# EAGLE design xor-oscillator (EAGLE 5.11)
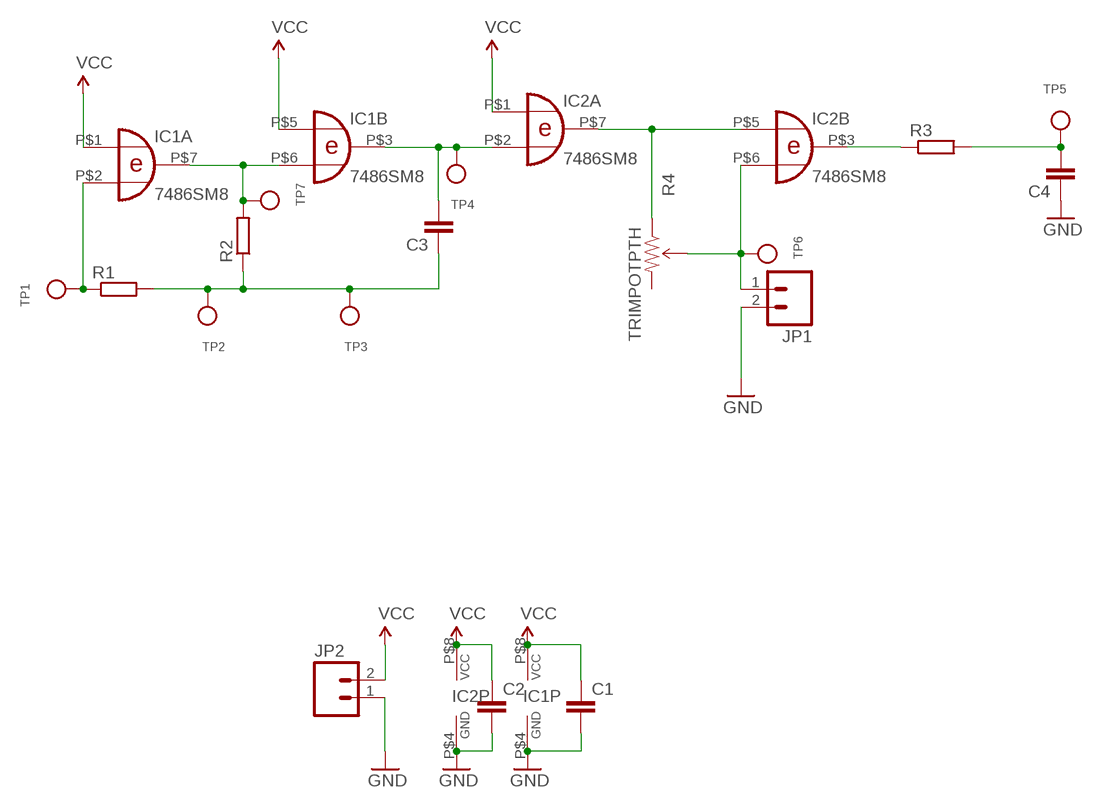
[diagram p0: schematic, sheet 1]

## Parts
C1  C-EUC0603  [C0603]
C2  C-EUC0603  [C0603]
C3  C-EUC0805  [C0805]
C4  C-EUC0805  [C0805]
IC1  7486SM8  [SM8(DCT)]
IC2  7486SM8  [SM8(DCT)]
JP1  M02PTH3  [1X02_LONGPADS]
JP2  M02PTH3  [1X02_LONGPADS]
R1  R-EU_R0805  [R0805]
R2  R-EU_R0805  [R0805]
R3  R-EU_R0805  [R0805]
R4  TRIMPOTPTH  [TRIM_POT_PTH]
TP1  TESTPOINTPAD  [TESTPOINT_PAD_2MM]
TP2  TESTPOINTPAD  [TESTPOINT_PAD_2MM]
TP3  TESTPOINTPAD  [TESTPOINT_PAD_2MM]
TP4  TESTPOINTPAD  [TESTPOINT_PAD_2MM]
TP5  TESTPOINTPAD  [TESTPOINT_PAD_2MM]
TP6  TESTPOINTPAD  [TESTPOINT_PAD_2MM]
TP7  TESTPOINTPAD  [TESTPOINT_PAD_2MM]

## Nets
GND: C1.2 C2.2 C4.1 IC1.P$4(P:GND) IC2.P$4(P:GND) JP1.2 JP2.1
N$1: IC1.P$6(B:I1) IC1.P$7(A:O) R2.2 TP7.P$1
N$3: C3.1 R1.2 R2.1 TP2.P$1 TP3.P$1
N$4: IC1.P$2(A:I1) R1.1 TP1.P$1
N$6: IC2.P$3(B:O) R3.1
N$7: C4.2 R3.2 TP5.P$1
N$8: IC2.P$6(B:I1) JP1.1 R4.2(WIPER) TP6.P$1
OSC: C3.2 IC1.P$3(B:O) IC2.P$2(A:I1) TP4.P$1
OSC_OUT: IC2.P$5(B:I0) IC2.P$7(A:O) R4.1(CCW)
VCC: C1.1 C2.1 IC1.P$1(A:I0) IC1.P$5(B:I0) IC1.P$8(P:VCC) IC2.P$1(A:I0) IC2.P$8(P:VCC) JP2.2
Unconnected: R4.3(CW)

## Library data of the parts
C1-C4 = rcl:C-EU: CAPACITOR, European symbol
IC1 IC2 = mic-misc:74*86: Quad 2-input EXCLUSIVE-OR (XOR) gate
JP1 JP2 = SparkFun:M02: Header 2 Standard 2-pin 0.1" header. Use with straight break away headers (SKU : PRT-00116), right angle break away headers (PRT-00553), swiss pins (PRT-00743), machine pins (PRT-00117), and female headers (PRT-00115). Molex polarized connector foot print use with SKU : PRT-08233 with associated crimp pins and housings.
R1-R3 = resistor:R-EU_: RESISTOR, European symbol
R4 = SparkFun:TRIMPOT
TP1-TP7 = microbuilder:TESTPOINT: Test Point TESTPOINT_SMT - Compact Surface Mount Test Point [Digikey: 5016KTR-ND] TESTPOINT_PAD - Square Pad (2mm) TESTPOINT_SMT - Round Pad (2mm) TESTPOINT_0.1" - 0.1" Header

## Board
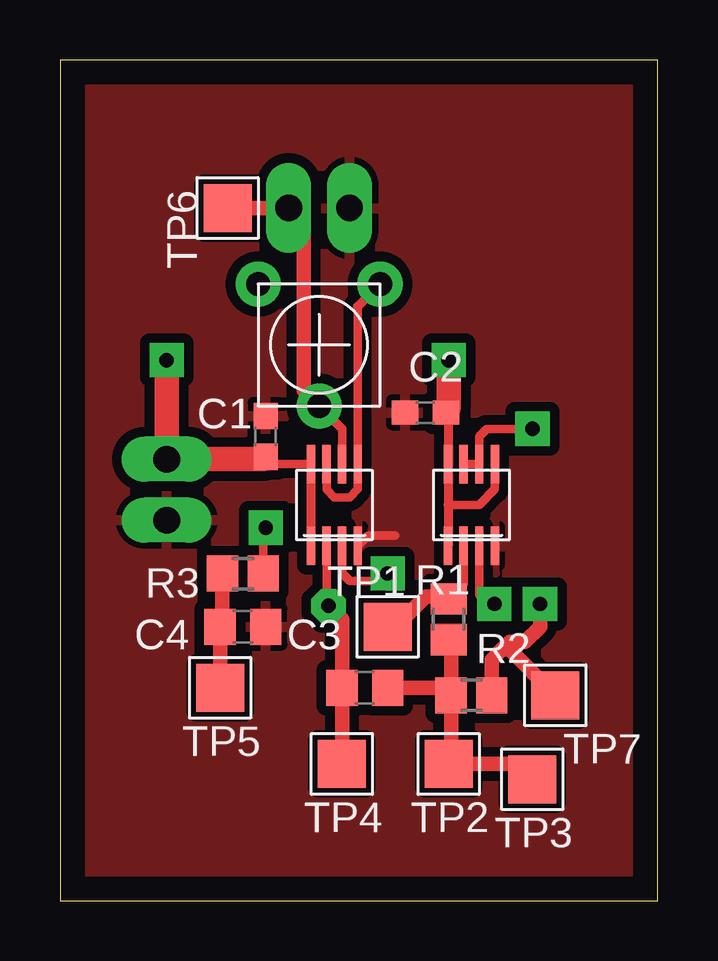
[diagram p1: board, top side]
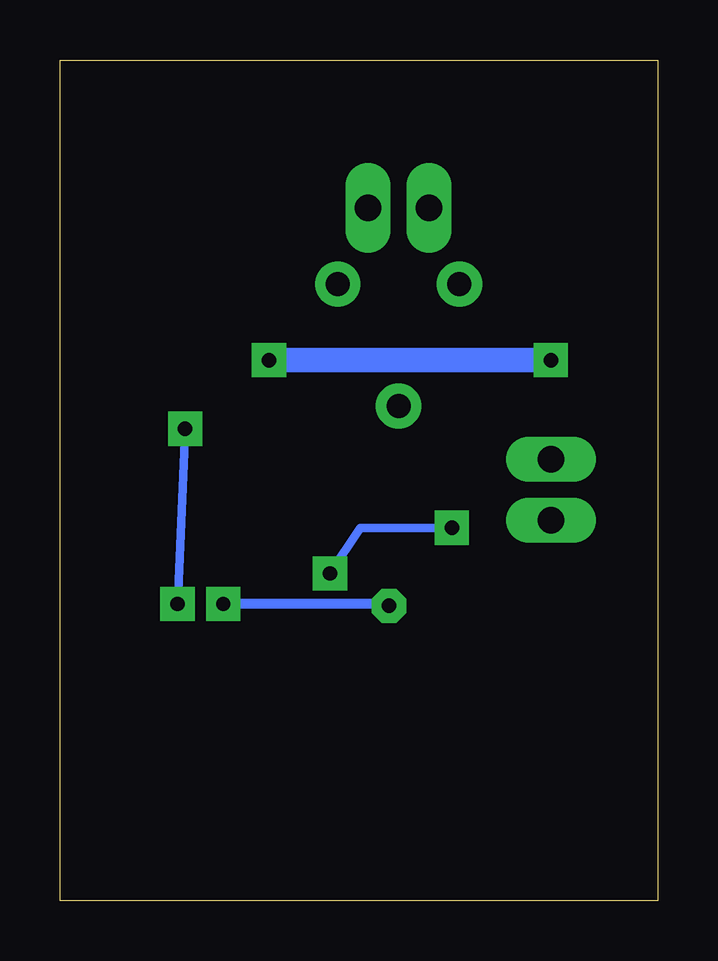
[diagram p2: board, bottom side, seen from below]

Size 24.9 x 35.06 mm. Coordinates in mm from the lower left corner, seen from the top.
Outline: 0,0 24.9,0 24.9,35.06 0,35.06 0,0
Copper layers (1*16): Top 0.035mm / dielectric 1.5mm / Bottom 0.035mm
Design rules "default": minimum track width 10mil, minimum drill 24mil, track to track 8mil, track to pad 8mil, pad to pad 8mil, via to via 8mil, smd to smd 8mil, copper to edge 40mil, drill to drill 8mil, minimum pad ring 10mil, minimum via ring 8mil, stop-mask expansion 4mil, vias tented up to drill 0mil, thermal gap 10mil

### Footprints (pad centres in the part's own frame; a part is rotated, then mirrored left to right if it is on the bottom)
C0603 = smd 1.1 x 1: 1 -0.85,0; 2 0.85,0
C0805 = smd 1.3 x 1.5: 1 -0.95,0; 2 0.95,0
SM8(DCT) = smd 0.35 x 1.6: P$1 -0.975,-1.7; P$2 -0.325,-1.7; P$3 0.325,-1.7; P$4 0.975,-1.7; P$5 0.975,1.7; P$6 0.325,1.7; P$7 -0.325,1.7; P$8 -0.975,1.7
1X02_LONGPADS = drill 1.118 pad 1.88 long: 1 0,0; 2 2.54,0
R0805 = smd 1.3 x 1.5: 1 -0.85,0; 2 0.85,0
TRIM_POT_PTH = drill 1 pad 1.88 round: 1 -2.54,-2.54; 2 0,2.54; 3 2.54,-2.54
TESTPOINT_PAD_2MM = smd 2 x 2: P$1 0,0

### Placement (x,y rotation side)
C1  8.57,19.37 90 top
C2  15.22,20.36 180 top
C3  12.7,8.89 180 top
C4  7.62,11.43 180 top
IC1  17.14,16.51 0 top
IC2  11.43,16.51 0 top
JP1  9.53,28.89 0 top
JP2  4.45,15.88 90 top
R1  16.19,11.75 270 top
R2  17.14,8.57 0 top
R3  7.62,13.65 180 top
R4  10.79,23.18 180 top
TP1  13.65,11.43 0 top
TP2  16.19,5.71 0 top
TP3  19.68,5.08 0 top
TP4  11.75,5.71 0 top
TP5  6.67,8.89 0 top
TP6  6.99,28.89 90 top
TP7  20.64,8.57 0 top

### Tracks (layer width: path | path; a pad name or v marks a point on that pad's centre or on a via)
GND
  Top 0.356: IC2.P$4 12.84,15.24 13.97,15.24
  pour Top (isolate 0.406): 0,35.24 24.13,35.24 24.13,0 0,0
N$1  (via drill 0.6 pad 1.42)
  Top 0.356: IC1.P$7 IC1.P$6 17.46,19.37 17.78,19.68 v19.68,19.68
  Top 0.61: R2.2 18,10.06 18.41,10.48 | 18.41,10.48 18.73,10.79 19.37,10.79 20,11.43 v20,12.38 | TP7.P$1 18.73,10.48 18.41,10.48
  Bottom 0.356: v20,12.38 v19.68,19.68
N$3
  Top 0.61: R1.2 16.3,10.79 R2.1 | C3.1 15.98,8.89 R2.1 | R2.1 16.3,5.82 TP2.P$1 19.05,5.71 TP3.P$1
N$4
  Top 0.356: IC1.P$2 16.82,13.22 R1.1
  Top 0.61: R1.1 16.09,12.7 15.24,12.7 13.97,11.43 TP1.P$1
N$6  (via drill 0.6 pad 1.42)
  Top 0.356: IC2.P$3 11.76,13.64 12.06,13.34 13.34,13.34 v13.65,13.65 | v8.57,15.56 8.47,15.46 R3.1
  Bottom 0.356: v13.65,13.65 12.38,15.56 v8.57,15.56
N$7
  Top 0.61: R3.2 6.77,11.53 C4.2 TP5.P$1
N$8
  Top 0.356: IC2.P$6 11.76,19.68
  Top 0.381: 11.76,19.68 R4.2
  Top 0.61: TP6.P$1 JP1.1 10.16,28.26 10.16,21.27 R4.2
OSC  (via drill 0.6 pad 1.42)
  Top 0.356: IC2.P$2 11.11,12.39 v11.19,12.3 | IC1.P$3 17.47,12.75 17.59,12.63
  Top 0.406: v18.1,12.38 17.59,12.63
  Top 0.61: v11.19,12.3 11.75,11.74 C3.2 TP4.P$1
  Bottom 0.406: v18.1,12.38 11.43,12.38 v11.19,12.3
OSC_OUT
  Top 0.356: IC2.P$7 11.11,17.14 11.43,16.83 12.06,16.83 12.4,17.17 IC2.P$5 12.4,24.79
  Top 0.381: 12.4,24.79 R4.1
VCC  (via drill 0.6 pad 1.42)
  Top 0.356: IC1.P$5 18.12,17.17 17.46,16.51 16.17,16.51 | IC2.P$8 8.88,18.21 C1.1
  Top 0.381: C2.1 16.17,20.39 IC1.P$8 16.17,16.51 IC1.P$1 | IC2.P$8 IC2.P$1
  Top 1.016: v4.45,22.54 JP2.2 8.47,18.41 C1.1 | v16.19,22.54 16.19,20.57 C2.1
  Bottom 1.016: v4.45,22.54 v16.19,22.54